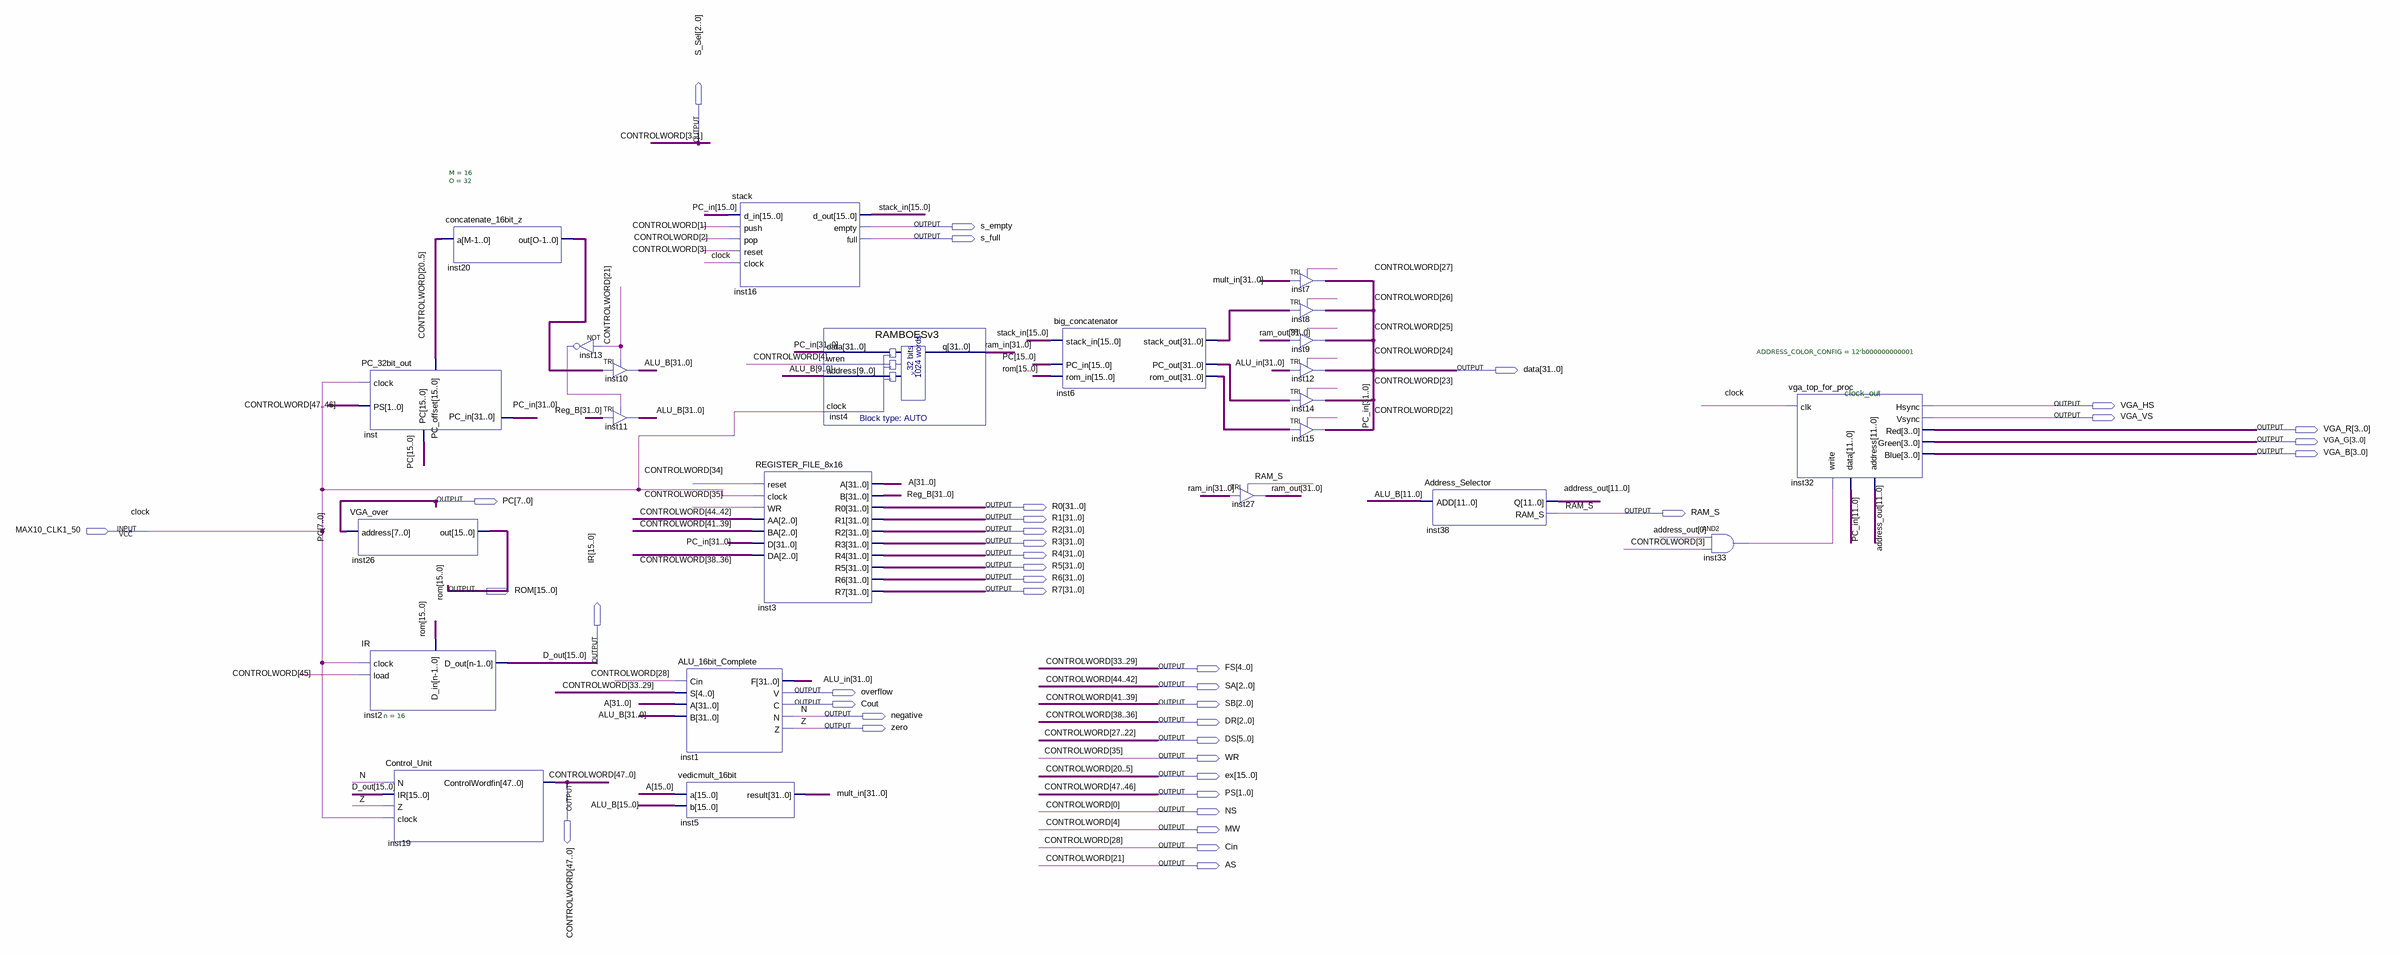
[diagram p0: schematic sheet]
// Quartus schematic CPU.bdf as structural Verilog: 24 symbols, 39 pins
module CPU (
  input  MAX10_CLK1_50,
  output [2:0] S_Sel,
  output s_empty,
  output s_full,
  output [31:0] data,
  output VGA_HS,
  output VGA_VS,
  output [3:0] VGA_R,
  output [3:0] VGA_G,
  output [3:0] VGA_B,
  output [15:0] PC,
  output [31:0] R0,
  output RAM_S,
  output [31:0] R1,
  output [31:0] R2,
  output [31:0] R3,
  output [31:0] R4,
  output [31:0] R5,
  output [31:0] R6,
  output [15:0] ROM,
  output [31:0] R7,
  output [15:0] IR,
  output [4:0] FS,
  output [2:0] SA,
  output overflow,
  output Cout,
  output [2:0] SB,
  output negative,
  output [2:0] DR,
  output zero,
  output [5:0] DS,
  output WR,
  output [15:0] ex,
  output [47:0] CONTROLWORD,
  output [1:0] PS,
  output NS,
  output MW,
  output Cin,
  output AS
);

  wire inst13_out, inst33_out;
  wire [11:0] address_out;
  wire [15:0] stack_in;
  wire [31:0] A, ALU_B, ALU_in, inst6_pc_out, inst6_rom_out, inst6_stack_out, inst20_out, mult_in, ram_in,
       ram_out, Reg_B;

  VGA_over inst26 (.address(PC[7:0]), .out(ROM));
  PC_32bit_out inst (
    .clock(MAX10_CLK1_50), .PS(CONTROLWORD[47:46]), .PC_in(data), .PC_offset(CONTROLWORD[20:5]), .PC(PC));
  IR #(.n(16)) inst2 (.clock(MAX10_CLK1_50), .load(CONTROLWORD[45]), .D_in(ROM), .D_out(IR));
  Control_Unit inst19 (
    .N(negative), .IR(IR), .Z(zero), .clock(MAX10_CLK1_50),
    .ControlWordfin({CONTROLWORD[47:29], Cin, CONTROLWORD[27:22], AS, CONTROLWORD[20:0]}));
  concatenate_16bit_z #(.M(16), .O(32)) inst20 (.a(CONTROLWORD[20:5]), .out(inst20_out));
  not inst13 (inst13_out, AS);
  TRI inst10[31:0] (.IN(inst20_out), .OE(AS), .OUT(ALU_B));
  TRI inst11[31:0] (.IN(Reg_B), .OE(inst13_out), .OUT(ALU_B));
  ALU_16bit_Complete inst1 (
    .S(CONTROLWORD[33:29]), .A(A), .B(ALU_B), .Cin(Cin), .F(ALU_in), .V(overflow), .C(Cout), .N(negative),
    .Z(zero));
  vedicmult_16bit inst5 (.a(A[15:0]), .b(ALU_B[15:0]), .result(mult_in));
  stack inst16 (
    .d_in(data[15:0]), .push(CONTROLWORD[1]), .pop(CONTROLWORD[2]), .reset(CONTROLWORD[3]),
    .clock(MAX10_CLK1_50), .d_out(stack_in), .empty(s_empty), .full(s_full));
  REGISTER_FILE_8x16 inst3 (
    .reset(CONTROLWORD[34]), .clock(MAX10_CLK1_50), .WR(CONTROLWORD[35]), .AA(CONTROLWORD[44:42]),
    .BA(CONTROLWORD[41:39]), .D(data), .DA(CONTROLWORD[38:36]), .A(A), .B(Reg_B), .R0(R0), .R1(R1), .R2(R2),
    .R3(R3), .R4(R4), .R5(R5), .R6(R6), .R7(R7));
  RAMBOESv3 inst4 (.data(data), .wren(CONTROLWORD[4]), .address(ALU_B[9:0]), .clock(MAX10_CLK1_50), .q(ram_in));
  big_concatenator inst6 (
    .stack_in(stack_in), .PC_in(PC), .rom_in(ROM), .stack_out(inst6_stack_out), .PC_out(inst6_pc_out),
    .rom_out(inst6_rom_out));
  TRI inst27[31:0] (.IN(ram_in), .OE(RAM_S), .OUT(ram_out));
  TRI inst7[31:0] (.IN(mult_in), .OE(CONTROLWORD[27]), .OUT(data));
  TRI inst8[31:0] (.IN(inst6_stack_out), .OE(CONTROLWORD[26]), .OUT(data));
  TRI inst9[31:0] (.IN(ram_out), .OE(CONTROLWORD[25]), .OUT(data));
  TRI inst12[31:0] (.IN(ALU_in), .OE(CONTROLWORD[24]), .OUT(data));
  TRI inst14[31:0] (.IN(inst6_pc_out), .OE(CONTROLWORD[23]), .OUT(data));
  TRI inst15[31:0] (.IN(inst6_rom_out), .OE(CONTROLWORD[22]), .OUT(data));
  Address_Selector inst38 (.ADD(ALU_B[11:0]), .Q(address_out), .RAM_S(RAM_S));
  and inst33 (inst33_out, address_out[0], CONTROLWORD[3]);
  vga_top_for_proc #(.ADDRESS_COLOR_CONFIG(12'b000000000001)) inst32 (
    .clk(MAX10_CLK1_50), .write(inst33_out), .data(data[11:0]), .address(address_out), .Hsync(VGA_HS),
    .Vsync(VGA_VS), .Red(VGA_R), .Green(VGA_G), .Blue(VGA_B));

  assign {CONTROLWORD[28], CONTROLWORD[21]} = {Cin, AS};
  assign DR = CONTROLWORD[38:36];
  assign DS = CONTROLWORD[27:22];
  assign ex = CONTROLWORD[20:5];
  assign FS = CONTROLWORD[33:29];
  assign MW = CONTROLWORD[4];
  assign NS = CONTROLWORD[0];
  assign PS = CONTROLWORD[47:46];
  assign S_Sel = CONTROLWORD[3:1];
  assign SA = CONTROLWORD[44:42];
  assign SB = CONTROLWORD[41:39];
  assign WR = CONTROLWORD[35];

  // Other names for the same wires on the sheet: clock = MAX10_CLK1_50; D_out[15:0] = IR; N = negative;
  //   PC_in[31:0] = data; Z = zero

  // Notes on the sheet:
  //   clock_out
endmodule
